# EAGLE design driver (EAGLE 9.6.2)
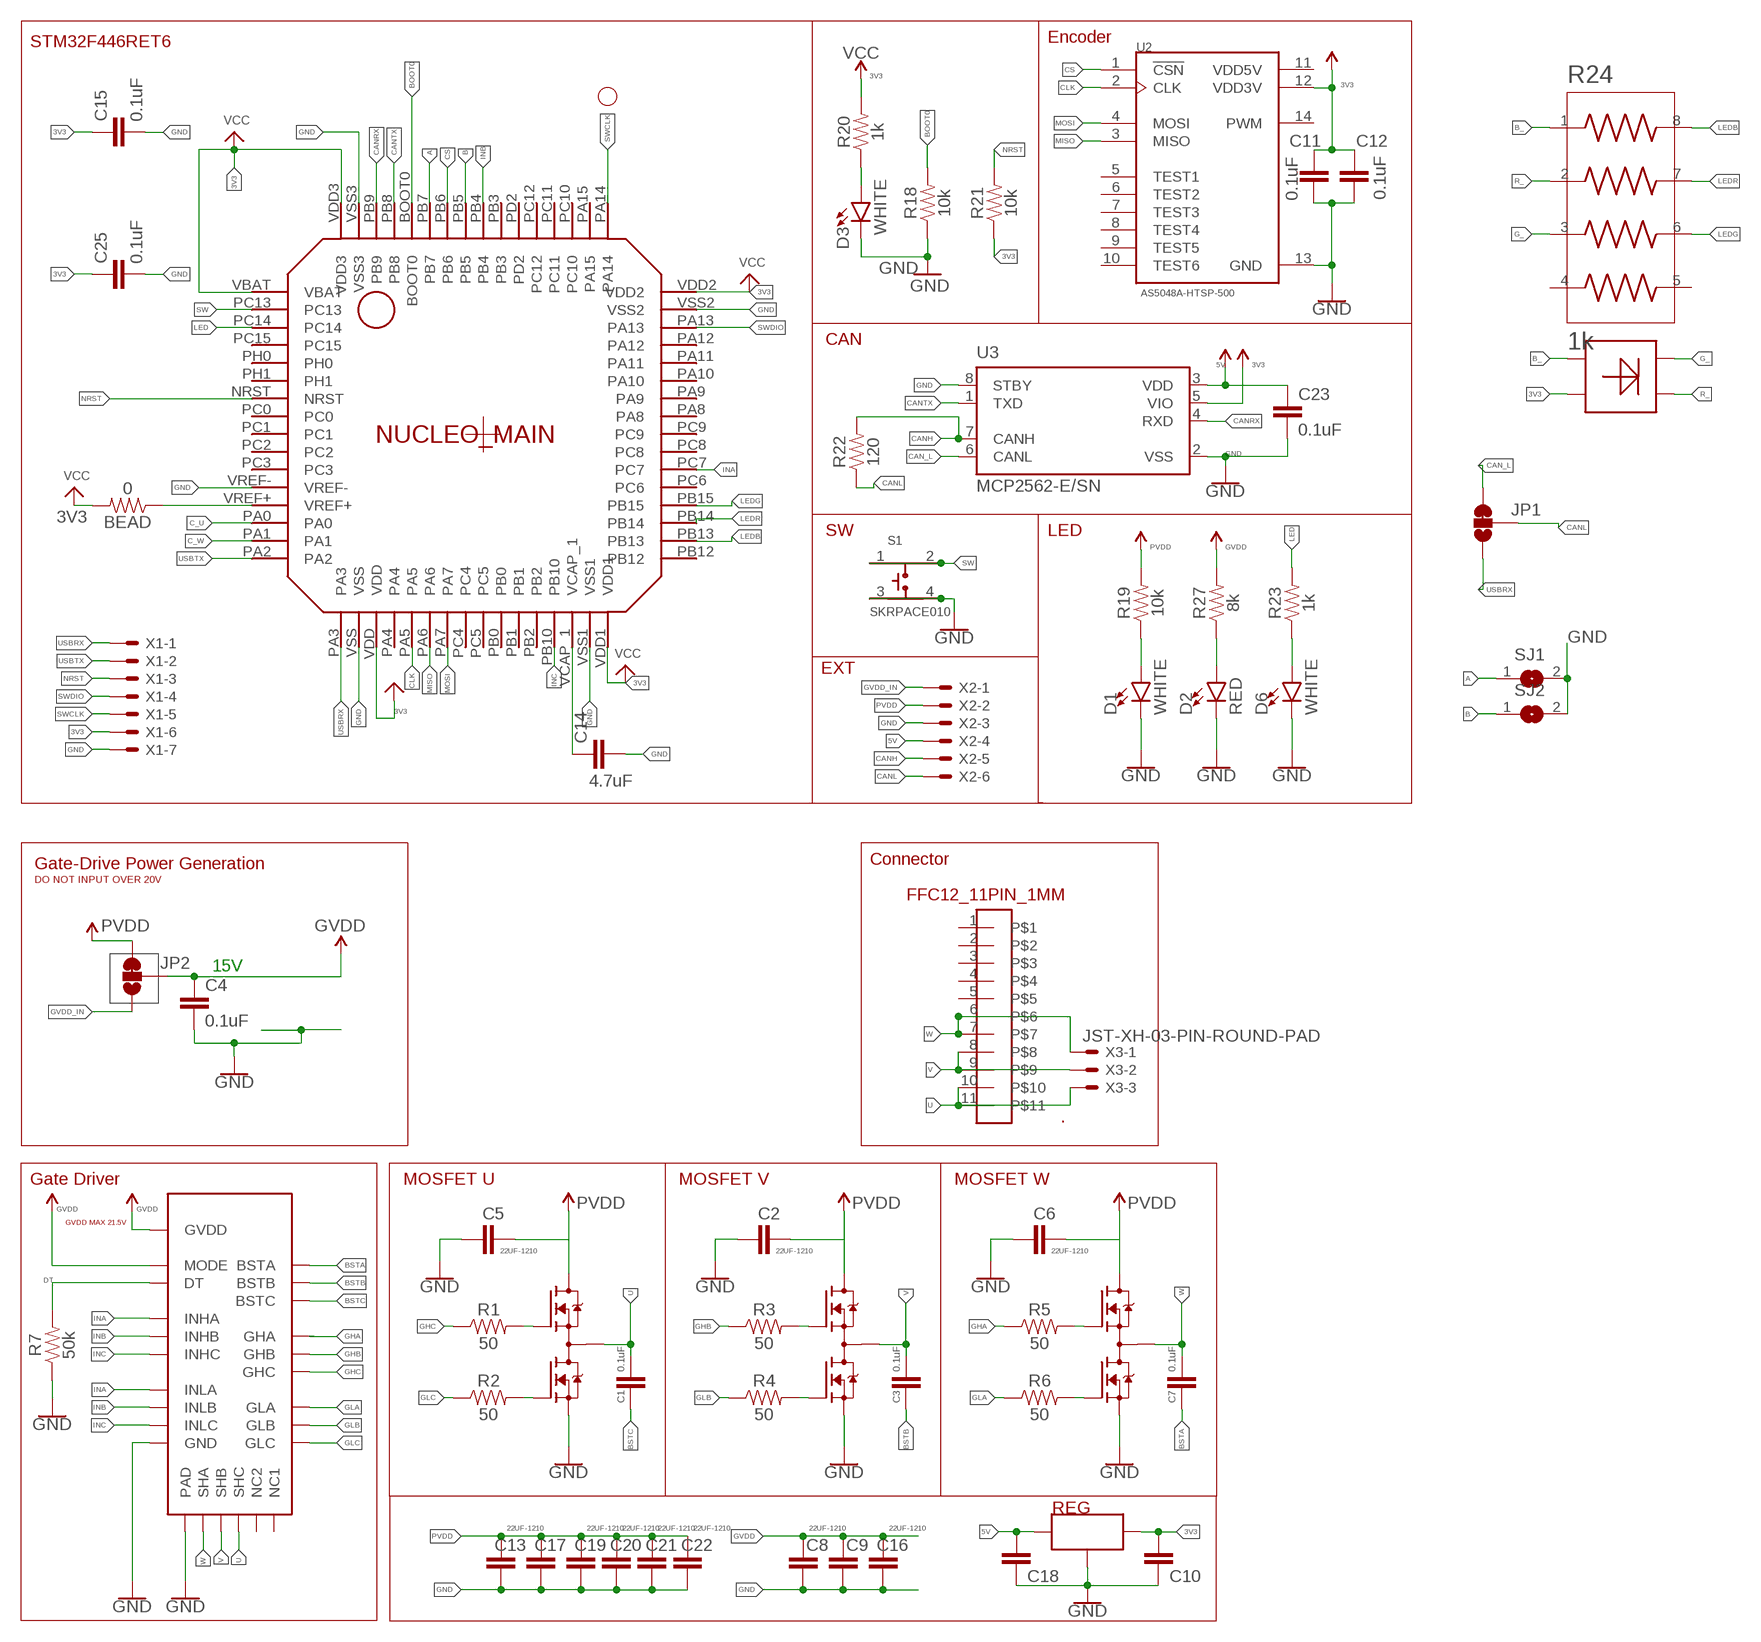
[diagram p0: schematic, sheet 1]

## Parts
.  FFC12_11PIN_1MM  [CON-SMT-FFCFPC_52207-1185]
BEAD  0  0OHM-0603-1/10W-5%  [0603]
C1  0.1uF  0.1UF-0603-25V-5%  [0603]
C2  22UF-1210  22UF-1210-16V-20%  [1210]
C3  0.1uF  0.1UF-0603-25V-5%  [0603]
C4  0.1uF  0.1UF-0603-100V-10%  [0603]
C5  22UF-1210  22UF-1210-16V-20%  [1210]
C6  22UF-1210  22UF-1210-16V-20%  [1210]
C7  0.1uF  0.1UF-0603-25V-5%  [0603]
C8  22UF-1210  22UF-1210-16V-20%  [1210]
C9  22UF-1210  22UF-1210-16V-20%  [1210]
C10  0.1UF  0.1UF_1608  [1608]
C11  0.1uF  0.1UF-0603-100V-10%  [0603]
C12  0.1uF  0.1UF-0603-100V-10%  [0603]
C13  22UF-1210  22UF-1210-16V-20%  [1210]
C14  4.7uF  0.1UF-0603-25V-(+80/-20%)  [0603]
C15  0.1uF  0.1UF-0603-25V-(+80/-20%)  [0603]
C16  22UF-1210  22UF-1210-16V-20%  [1210]
C17  22UF-1210  22UF-1210-16V-20%  [1210]
C18  0.1UF  0.1UF_1608  [1608]
C19  22UF-1210  22UF-1210-16V-20%  [1210]
C20  22UF-1210  22UF-1210-16V-20%  [1210]
C21  22UF-1210  22UF-1210-16V-20%  [1210]
C22  22UF-1210  22UF-1210-16V-20%  [1210]
C23  0.1uF  0.1UF-0603-100V-10%  [0603]
C25  0.1uF  0.1UF-0603-25V-(+80/-20%)  [0603]
D1  WHITE  LED-WHITE0603  [LED-0603]
D2  RED  LED-RED0603  [LED-0603]
D3  WHITE  LED-WHITE0603  [LED-0603]
D6  WHITE  LED-WHITE0603  [LED-0603]
JP1  JUMPER-SMT_3_1-NC_TRACE_SILK  [SMT-JUMPER_3_1-NC_TRACE_SILK]
JP2  JUMPER-SMT_3_1-NC_TRACE_SILK  [SMT-JUMPER_3_1-NC_TRACE_SILK]
NUCLEO_MAIN  F446RET6  STM32F446RET6  [STM32F446RET6]
Q2  SIZ240DT-T1-GE3  [TRANS_SIZ240DT-T1-GE3]
Q3  SIZ240DT-T1-GE3  [TRANS_SIZ240DT-T1-GE3]
Q4  SIZ240DT-T1-GE3  [TRANS_SIZ240DT-T1-GE3]
R1  50  1KOHM-0603-1/10W-1%  [0603]
R2  50  1KOHM-0603-1/10W-1%  [0603]
R3  50  1KOHM-0603-1/10W-1%  [0603]
R4  50  1KOHM-0603-1/10W-1%  [0603]
R5  50  1KOHM-0603-1/10W-1%  [0603]
R6  50  1KOHM-0603-1/10W-1%  [0603]
R7  50k  1KOHM-0603-1/10W-1%  [0603]
R18  10k  RESISTOR-0603-1/10W-1%  [R0603]
R19  10k  2.0KOHM-0603-1/10W-5%  [0603]
R20  1k  RESISTOR-0603-1/10W-1%  [R0603]
R21  10k  RESISTOR-0603-1/10W-1%  [R0603]
R22  120  2.0KOHM-0603-1/10W-5%  [0603]
R23  1k  2.0KOHM-0603-1/10W-5%  [0603]
R24  1k  MNR04M0APJ334  [RESCAXS50P200X100X45-8N]
R27  8k  2.0KOHM-0603-1/10W-5%  [0603]
REG  AP7333  [SOT95P237X112-3N]
S1  SKRPACE010  [SW_SKRPACE010]
SJ1  SJ  [SJ]
SJ2  SJ  [SJ]
U1  QFN50P400X400X100-25NDRV8300DRGER  [QFN50P400X400X100-25N]
U2  AS5048A-HTSP-500  [SOP65P640X120-14N]
U3  MCP2562-E/SN  [SOIC127P600X175-8N]
U$1  LED  [LED_AAA3528LSEKJ3ZGKQBKS]
X1  JST-XH-07-PIN-ROUND-PAD  [JST-XH-07-PACKAGE-ROUND-PAD]
X2  JST-XH-06-PIN-LONG-PAD  [JST-XH-06-PACKAGE-LONG-PAD]
X3  JST-XH-03-PIN-ROUND-PAD  [JST-XH-03-PACKAGE-ROUND-PAD]

## Nets
3V3: BEAD.2 C10.1 C11.1 C12.1 C15.1 C25.1 NUCLEO_MAIN.VBAT NUCLEO_MAIN.VDD NUCLEO_MAIN.VDD1 NUCLEO_MAIN.VDD2 NUCLEO_MAIN.VDD3 R20.2 R21.1 REG.2(OUT) U2.12(VDD3V) U3.5(VIO) U$1.4(GND) X1.6 ; supply symbol labelled PVDD, VCC, GVDD
5V: C18.1 C23.1 REG.1(IN) U3.3(VDD) X2.4 ; supply symbol labelled GVDD
A: NUCLEO_MAIN.PB7 SJ1.1
B: NUCLEO_MAIN.PB5 SJ2.1
B_: R24.1 U$1.1(B)
BOOT0: NUCLEO_MAIN.BOOT0 R18.2
BSTA: C7.1 U1.BSTA
BSTB: C3.1 U1.BSTB
BSTC: C1.1 U1.BSTC
C_U: NUCLEO_MAIN.PA0
C_W: NUCLEO_MAIN.PA1
CAN_L: JP1.3 U3.6(CANL)
CANH: R22.2 U3.7(CANH) X2.5
CANL: JP1.2 R22.1 X2.6
CANRX: NUCLEO_MAIN.PB9 U3.4(RXD)
CANTX: NUCLEO_MAIN.PB8 U3.1(TXD)
CLK: NUCLEO_MAIN.PA5 U2.2(CLK)
CS: NUCLEO_MAIN.PB6 U2.1(!CSN)
DT: R7.2 U1.DT
G_: R24.3 U$1.2(G)
GHA: R5.1 U1.GHA
GHB: R3.1 U1.GHB
GHC: R1.1 U1.GHC
GLA: R6.1 U1.GLA
GLB: R4.1 U1.GLB
GLC: R2.1 U1.GLC
GND: C2.1 C4.2 C5.1 C6.1 C8.1 C9.1 C10.2 C11.2 C12.2 C13.1 C14.2 C15.2 C16.1 C17.1 C18.2 C19.1 C20.1 C21.1 C22.1 C23.2 C25.2 D1.C D2.C D3.C D6.C NUCLEO_MAIN.VREF- NUCLEO_MAIN.VSS NUCLEO_MAIN.VSS1 NUCLEO_MAIN.VSS2 NUCLEO_MAIN.VSS3 Q2.5(S2) Q2.6(S2) Q2.7(S2) Q3.5(S2) Q3.6(S2) Q3.7(S2) Q4.5(S2) Q4.6(S2) Q4.7(S2) R7.1 R18.1 REG.3(GND) S1.3 S1.4 SJ1.2 SJ2.2 U1.GND U1.PAD U2.13(GND) U3.2(VSS) U3.8(STBY) X1.7 X2.3
GVDD: C4.1 C8.2 C9.2 C16.2 JP2.2 R27.2 U1.GVDD U1.MODE ; supply symbol labelled PVDD
GVDD_IN: JP2.1 X2.1
HA: Q4.1(G1) R5.2
HB: Q3.1(G1) R3.2
HC: Q2.1(G1) R1.2
INA: NUCLEO_MAIN.PC7 U1.INHA U1.INLA
INB: NUCLEO_MAIN.PB4 U1.INHB U1.INLB
INC: NUCLEO_MAIN.PB10 U1.INHC U1.INLC
L: D3.A R20.1
LA: Q4.8(G2) R6.2
LB: Q3.8(G2) R4.2
LC: Q2.8(G2) R2.2
LED: NUCLEO_MAIN.PC14 R23.2
LEDB: NUCLEO_MAIN.PB13 R24.8
LEDG: NUCLEO_MAIN.PB15 R24.6
LEDR: NUCLEO_MAIN.PB14 R24.7
MISO: NUCLEO_MAIN.PA6 U2.3(MISO)
MOSI: NUCLEO_MAIN.PA7 U2.4(MOSI)
N$14: D1.A R19.1
N$15: D2.A R27.1
N$21: D6.A R23.1
NRST: NUCLEO_MAIN.NRST R21.2 X1.3
PVDD: C2.2 C5.2 C6.2 C13.2 C17.2 C19.2 C20.2 C21.2 C22.2 JP2.3 Q2.2(D1) Q2.3(D1) Q2.4(D1) Q2.10(D1) Q3.2(D1) Q3.3(D1) Q3.4(D1) Q3.10(D1) Q4.2(D1) Q4.3(D1) Q4.4(D1) Q4.10(D1) R19.2 X2.2 ; supply symbol labelled GVDD
R_: R24.2 U$1.3(R)
SW: NUCLEO_MAIN.PC13 S1.1 S1.2
SWCLK: NUCLEO_MAIN.PA14 X1.5
SWDIO: NUCLEO_MAIN.PA13 X1.4
U: ..10 ..11 C1.2 Q2.9(S1/D2) U1.SHC X3.3
USBRX: JP1.1 NUCLEO_MAIN.PA3 X1.1
USBTX: NUCLEO_MAIN.PA2 X1.2
V: ..8 ..9 C3.2 Q3.9(S1/D2) U1.SHB X3.2
VCAP: C14.1 NUCLEO_MAIN.VCAP_1
VDDA: BEAD.1 NUCLEO_MAIN.VREF+
W: ..6 ..7 C7.2 Q4.9(S1/D2) U1.SHA X3.1
Unconnected: ..1 ..2 ..3 ..4 ..5 NUCLEO_MAIN.PA4 NUCLEO_MAIN.PA8 NUCLEO_MAIN.PA9 NUCLEO_MAIN.PA10 NUCLEO_MAIN.PA11 NUCLEO_MAIN.PA12 NUCLEO_MAIN.PA15 NUCLEO_MAIN.PB0 NUCLEO_MAIN.PB1 NUCLEO_MAIN.PB2 NUCLEO_MAIN.PB3 NUCLEO_MAIN.PB12 NUCLEO_MAIN.PC0 NUCLEO_MAIN.PC1 NUCLEO_MAIN.PC2 NUCLEO_MAIN.PC3 NUCLEO_MAIN.PC4 NUCLEO_MAIN.PC5 NUCLEO_MAIN.PC6 NUCLEO_MAIN.PC8 NUCLEO_MAIN.PC9 NUCLEO_MAIN.PC10 NUCLEO_MAIN.PC11 NUCLEO_MAIN.PC12 NUCLEO_MAIN.PC15 NUCLEO_MAIN.PD2 NUCLEO_MAIN.PH0 NUCLEO_MAIN.PH1 R24.4 R24.5 U1.NC1 U1.NC2 U2.5(TEST1) U2.6(TEST2) U2.7(TEST3) U2.8(TEST4) U2.9(TEST5) U2.10(TEST6) U2.14(PWM)

## Notes on the sheet
- STM32F446RET6 | Encoder
- CAN
- SW | LED
- Recommended
- EXT
- Gate-Drive Power Generation | Connector
- DO NOT INPUT OVER 20V
- 15V
- Gate Driver | MOSFET U | MOSFET V | MOSFET W
- GVDD MAX 21.5V

## Power pins joined to a net without a drawn wire
VDD5V: U2.11(VDD5V)

## Library data of the parts
. = MotorDriver_FourthEdition_prot:FFC12_11PIN_1MM
BEAD = SparkFun-Resistors:0OHM: 0Ω resistor A resistor is a passive two-terminal electrical component that implements electrical resistance as a circuit element. Resistors act to reduce current flow, and, at the same time, act to lower voltage levels within circuits. - Wikipedia; PROD_ID: RES-08609
C1 C3 C7 = SparkFun-Capacitors:0.1UF: 0.1µF ceramic capacitors A capacitor is a passive two-terminal electrical component used to store electrical energy temporarily in an electric field.; PROD_ID: CAP-08604
C2 C5 C6 C8 C9 C13 C16 C17 C19-C22 = SparkFun-Capacitors:22UF: 22µF ceramic capacitors A capacitor is a passive two-terminal electrical component used to store electrical energy temporarily in an electric field.
C4 C11 C12 C23 = SparkFun-Capacitors:0.1UF: 0.1µF ceramic capacitors A capacitor is a passive two-terminal electrical component used to store electrical energy temporarily in an electric field.; PROD_ID: CAP-08390
C10 C18 = Custom_Designed_By_Yusei:0.1UF_1608
C14 = SparkFun-Capacitors:0.1UF: 0.1µF ceramic capacitors A capacitor is a passive two-terminal electrical component used to store electrical energy temporarily in an electric field.; PROD_ID: CAP-00810; VALUE: 0.1uF
C15 C25 = SparkFun-Capacitors:0.1UF: 0.1µF ceramic capacitors A capacitor is a passive two-terminal electrical component used to store electrical energy temporarily in an electric field.; PROD_ID: CAP-00810
D1 D3 D6 = SparkFun-LED:LED-WHITE: White SMD LED Used in manufacturing several products at SparkFun. Packages: 0603 - Bright White SMD 0603 package[Product Link] <http://www.kingbrightusa.com/product.asp?catalog_name=LED&product_id=APT1608QWF/D> 1206 - Bright White SMD1206 package [Product Link] <http://www.kingbrightusa.com/product.asp?catalog_name=LED&product_id=APT3216QWF/D> 3014 - Super Bright SMD 3014 package [Datasheet] <http://www.lumileds.com/uploads/459/DS208-pdf> SparkFun Products: Blackberry Trackballer Breakout <https://www.sparkfun.com/products/13169> Digital SandBox <https://www.sparkfun.com/products/12651>; PROD_ID: DIO-09004
D2 = SparkFun-LED:LED-RED: Red SMD LED Used in manufacturing of most products at SparkFun Packages: 0603 - SMD 0603 package [Product Link] <http://docs.avagotech.com/docs/AV02-0551EN> 0603 SMART - SMD 0603 SMART package ( more efficient and expensive)[Product Link] <http://www.osram-os.com/Graphics/XPic2/00077099_0.pdf> 1206 - SMD1206 package [Product Link] <https://www.sparkfun.com/datasheets/DevTools/LilyPad/Q150OVS4.pdff> SparkFun Products: Pro Mini 328 -5V <https://www.sparkfun.com/products/821> RedBoard <https://www.sparkfun.com/products/12757> IOIO-OTG <https://www.sparkfun.com/products/13613>; PROD_ID: DIO-00819
JP1 JP2 = SparkFun-Jumpers:JUMPER-SMT_3_1-NC_TRACE: Normally closed trace jumper (1 of 2 connections) This jumper has a trace between two pads so it's normally closed (NC). The other connection is normally open (NO). Use a razor knife to open the connection. For best results follow the IPC guidelines for cutting traces: Cutout at least 0.063 mm (0.005 in). Remove all loose material to clean up the cut area. Seal the cut with an approved epoxy. Reapply solder to reclose the connection, or to close the NO connection.
NUCLEO_MAIN = STM32F446RET6:STM32F446RET6
Q2-Q4 = SIZ240DT-T1-GE3:SIZ240DT-T1-GE3: Check availability <https://pricing.snapeda.com/parts/SIZ240DT-T1-GE3/Vishay%20Siliconix/view-part?ref=eda>; AVAILABILITY: In Stock; DESCRIPTION: Mosfet Array 2 N-Channel (Dual) 40V 17.2A (Ta), 48A (Tc), 16.9A (Ta), 47A (Tc) 4.3W (Ta), 33W (Tc) Surface Mount 8-PowerPair® (3.3x3.3); MF: Vishay Siliconix; MP: SIZ240DT-T1-GE3; PACKAGE: PowerWDFN-8 Vishay Siliconix; PRICE: None; PURCHASE-URL: https://pricing.snapeda.com/search/part/SIZ240DT-T1-GE3/?ref=eda
R1-R7 = SparkFun-Resistors:1KOHM: 1kΩ resistor A resistor is a passive two-terminal electrical component that implements electrical resistance as a circuit element. Resistors act to reduce current flow, and, at the same time, act to lower voltage levels within circuits. - Wikipedia; PROD_ID: RES-07856; VALUE: 1k
R18 R21 = Custom_Designed_By_Yusei:RESISTOR: Resistor; PROD_ID: RES-07856; VALUE: 1k
R19 R22 R23 R27 = SparkFun-Resistors:2.0KOHM: 2kΩ resistor A resistor is a passive two-terminal electrical component that implements electrical resistance as a circuit element. Resistors act to reduce current flow, and, at the same time, act to lower voltage levels within circuits. - Wikipedia; PROD_ID: RES-08296; VALUE: 2.0k
R20 = Custom_Designed_By_Yusei:RESISTOR: Resistor; PROD_ID: RES-07856
R24 = MNR04M0APJ334:MNR04M0APJ334: Res Array 330K Ohm 5% ±200ppm/°C ISOL Epoxy 8-Pin 0804(4 X 0402) Convex SMD Automotive T/R Check availability <https://pricing.snapeda.com/parts/MNR04M0APJ334/Rohm/view-part?ref=eda>; AVAILABILITY: In Stock; DESCRIPTION: Res Array 330K Ohm 5% ±200ppm/°C ISOL Epoxy 8-Pin 0804(4 X 0402) Convex SMD Automotive T/R; MF: Rohm; MP: MNR04M0APJ334; PACKAGE: 0402 Rohm; PRICE: None
REG = SOT95P237X112-3N:AP7333
S1 = Alps SW:SKRPACE010: Switch Tactile N.O. SPST Button J-Bend 0.05A 16VDC 2.55N SMD Automotive T/R; AVAILABILITY: Good; DESCRIPTION: Switch Tactile N.O. SPST Button J-Bend 0.05A 16VDC 2.55N SMD Automotive T/R; MF: ALPS; MP: SKRPACE010; PACKAGE: None; PRICE: 0.29 USD
SJ1 SJ2 = jumper:SJ: SMD solder JUMPER
U1 = DRV8300DRGER:QFN50P400X400X100-25N: DRV8300
U2 = AS5048A-HTSP-500:AS5048A-HTSP-500: AS5048B Series 360° 3.3 / 5 V 14 bit Magnetic Rotary Encoder - TSSOP-14 Check availability <https://pricing.snapeda.com/parts/AS5048A-HTSP-500/ams/view-part?ref=eda>; AVAILABILITY: In Stock; DESCRIPTION: Hall Effect Sensor Angle External Magnet, Not Included Gull Wing; MF: ams; MP: AS5048A-HTSP-500; PACKAGE: TSSOP-14 ams; PRICE: None; PURCHASE-URL: https://pricing.snapeda.com/search/part/AS5048A-HTSP-500/?ref=eda
U3 = MCP2562-E_SN:MCP2562-E/SN: MCP2562 Series 5 V Surface Mount High-Speed CAN Transceiver - SOIC-8 Check availability <https://pricing.snapeda.com/parts/MCP2562-E/SN/Microchip/view-part?ref=eda>; AVAILABILITY: In Stock; DESCRIPTION: 1/1 Transceiver Half CANbus 8-SOIC; MF: Microchip; MP: MCP2562-E/SN; PACKAGE: SO-8 Microchip; PRICE: None; PURCHASE-URL: https://pricing.snapeda.com/search/part/MCP2562-E/SN/?ref=eda
U$1 = LED_AAA3528LSEKJ3ZGKQBKS:LED
X1 = JST XH Connectors:JST-XH-07-PIN: JST XH Connector 2 Pin Wire to board connector. Pitch: 2,54 mm, (0.100") Number of pins: 7 Created by Rembrandt Electronics www.rembrandtelectronics.com
X2 = Rembrandt Electronics - JST XH Connectors v1-0:JST-XH-06-PIN: JST XH Connector 2 Pin Wire to board connector. Pitch: 2,54 mm, (0.100") Number of pins: 6 Created by Rembrandt Electronics www.rembrandtelectronics.com
X3 = JST XH Connectors:JST-XH-03-PIN: JST XH Connector 2 Pin Wire to board connector. Pitch: 2,54 mm, (0.100") Number of pins: 3 Created by Rembrandt Electronics www.rembrandtelectronics.com

## Net classes
0 default: width 0.3 mm

## Board
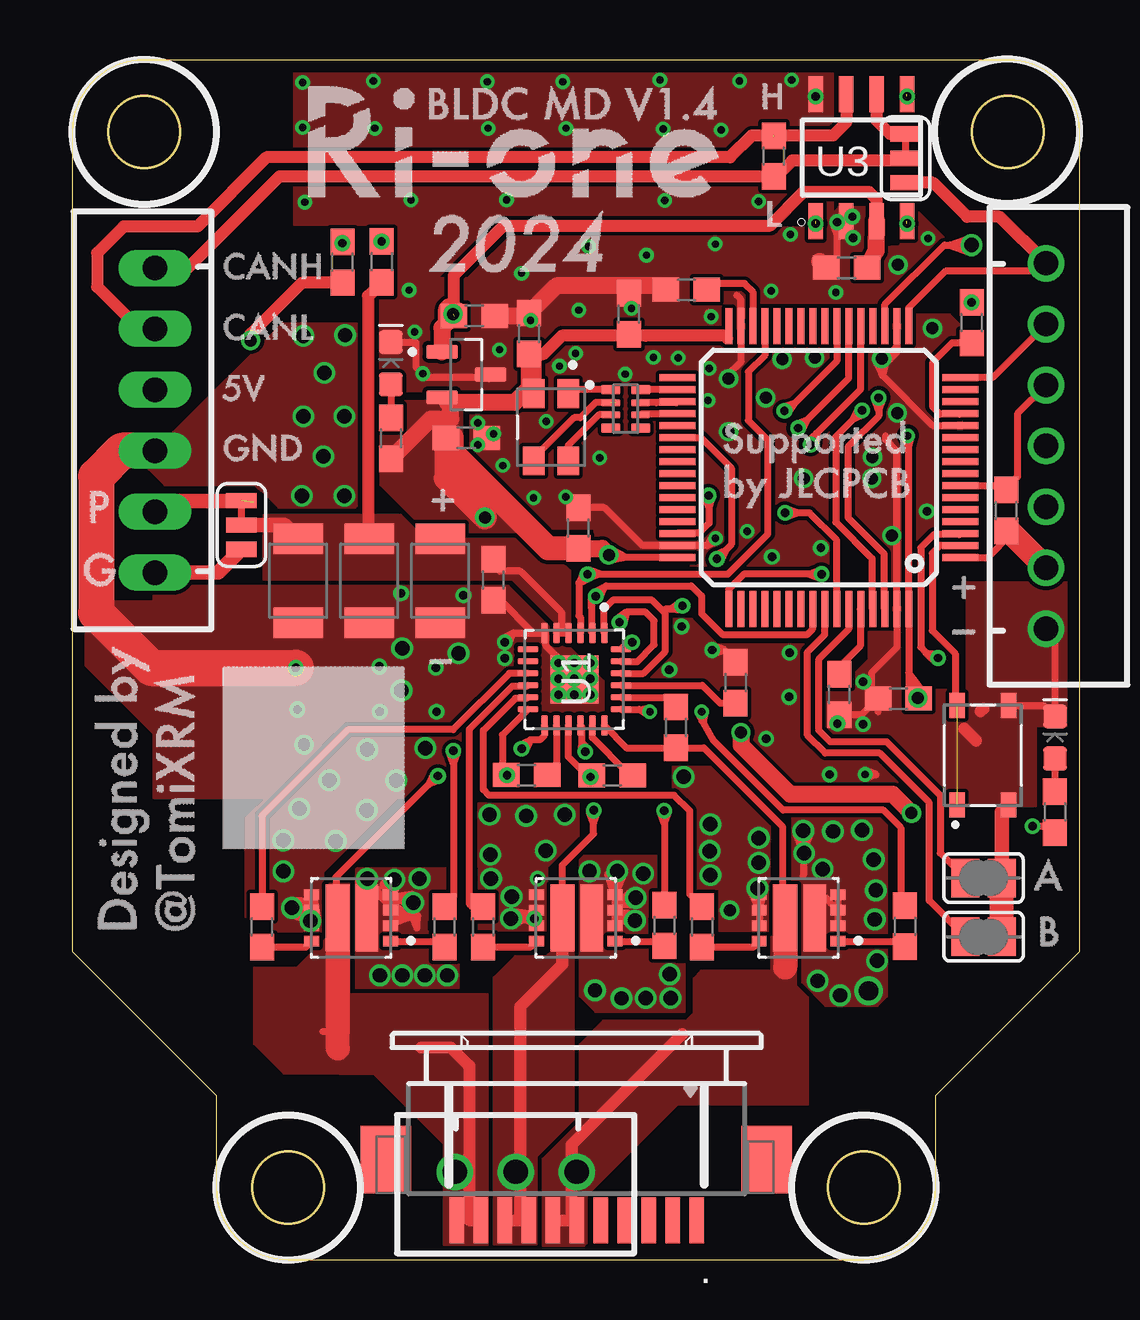
[diagram p1: board, top side]
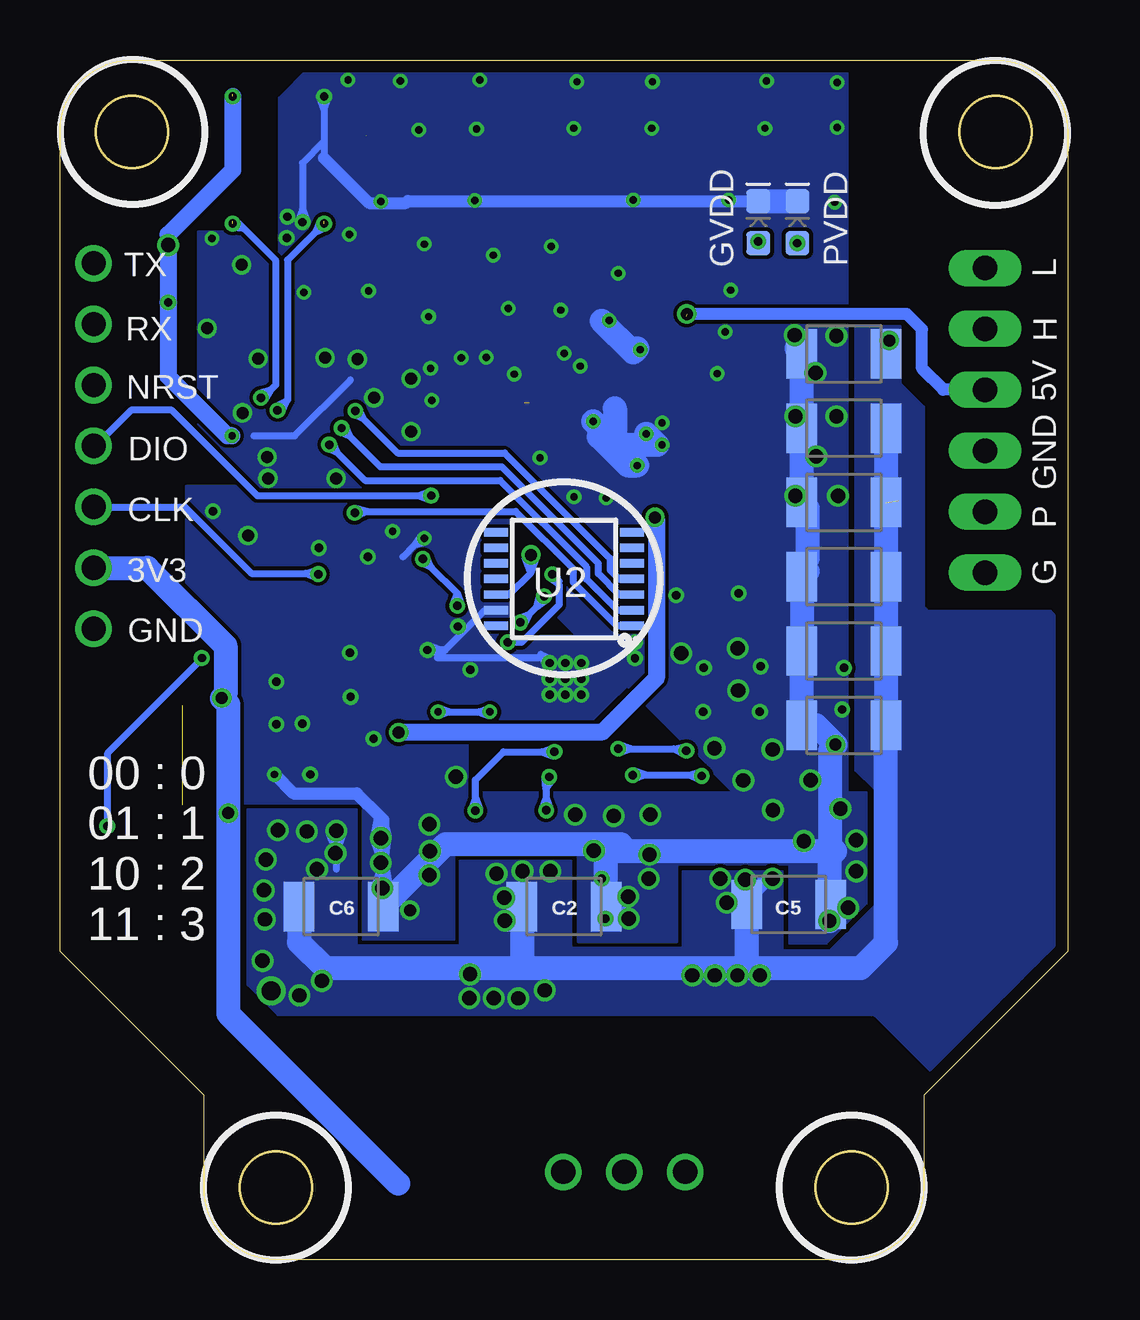
[diagram p2: board, bottom side, seen from below]

Size 42 x 50 mm. Coordinates in mm from the lower left corner, seen from the top.
Outline: 3,50 arc90 0,47 0,12.85 6,6.85 6,3 arc90 9,0 33,0 arc90 36,3 36,6.85 42,12.85 42,47 arc90 39,50 3,50
Outline: circle at 3,47 radius 1.5
Outline: circle at 39,47 radius 1.5
Outline: circle at 9,3 radius 1.5
Outline: circle at 33,3 radius 1.5
Outline: circle at 39,47 radius 1.5
Copper layers (1*16): Top 0.035mm / dielectric 1.6mm / Bottom 0.035mm
Design rules "Elecrow_2-layer_PCB_eagle_rule": minimum track width 6mil, minimum drill 12mil, track to track 6mil, track to pad 6mil, pad to pad 6mil, via to via 8mil, smd to smd 0mil, copper to edge 20mil, drill to drill 10mil, minimum pad ring 6mil, minimum via ring 6mil, stop-mask expansion 0mil, vias tented up to drill 100mil, thermal gap 10mil
tRestrict: area 6,0 to 12,6; area 30,0 to 36,6; area 0,44 to 6,50; area 36,44 to 42,50; 7 lines
bRestrict: area 0,44 to 6,50; area 36,44 to 42,50; 2 lines

### Footprints (pad centres in the part's own frame; a part is rotated, then mirrored left to right if it is on the bottom)
CON-SMT-FFCFPC_52207-1185 = smd 0.6 x 1.9: 1 -5,2.5; 2 -4,2.5; 3 -3,2.5; 4 -2,2.5; 5 -1,2.5; 6 0,2.5; 7 1,2.5; 8 2,2.5; 9 3,2.5; 10 4,2.5; 11 5,2.5 | smd 2.1 x 2.8: P$1 -7.93,-0.03; P$4 7.945,-0.03
0603 = smd 1.1 x 1: 1 -0.85,0; 2 0.85,0
1210 = smd 1.27 x 2.06: 1 -1.755,0; 2 1.755,0
1608 = smd 1.1 x 1: 1 -0.85,0; 2 0.85,0
LED-0603 = smd 1 x 1: A -0.877,0; C 0.877,0
SMT-JUMPER_3_1-NC_TRACE_SILK = smd 0.635 x 1.27: 1 -1.016,0; 2 0,0; 3 1.016,0
STM32F446RET6 = smd 0.3 x 1.5: BOOT0 -1.75,5.9; PA3 -3.75,-5.9; PA4 -2.25,-5.9; PA5 -1.75,-5.9; PA6 -1.25,-5.9; PA7 -0.75,-5.9; PA14 3.75,5.9; PA15 3.25,5.9; PB0 0.75,-5.9; PB1 1.25,-5.9; PB2 1.75,-5.9; PB3 0.75,5.9; PB4 0.25,5.9; PB5 -0.25,5.9; PB6 -0.75,5.9; PB7 -1.25,5.9; PB8 -2.25,5.9; PB9 -2.75,5.9; PB10 2.25,-5.9; PC4 -0.25,-5.9; PC5 0.25,-5.9; PC10 2.75,5.9; PC11 2.25,5.9; PC12 1.75,5.9; PD2 1.25,5.9; VCAP_1 2.75,-5.9; VDD -2.75,-5.9; VDD1 3.75,-5.9; VDD3 -3.75,5.9; VSS -3.25,-5.9; VSS1 3.25,-5.9; VSS3 -3.25,5.9 | smd 1.5 x 0.3: NRST -5.9,0.75; PA0 -5.9,-2.75; PA1 -5.9,-3.25; PA2 -5.9,-3.75; PA8 5.9,0.25; PA9 5.9,0.75; PA10 5.9,1.25; PA11 5.9,1.75; PA12 5.9,2.25; PA13 5.9,2.75; PB12 5.9,-3.75; PB13 5.9,-3.25; PB14 5.9,-2.75; PB15 5.9,-2.25; PC0 -5.9,0.25; PC1 -5.9,-0.25; PC2 -5.9,-0.75; PC3 -5.9,-1.25; PC6 5.9,-1.75; PC7 5.9,-1.25; PC8 5.9,-0.75; PC9 5.9,-0.25; PC13 -5.9,3.25; PC14 -5.9,2.75; PC15 -5.9,2.25; PH0 -5.9,1.75; PH1 -5.9,1.25; VBAT -5.9,3.75; VDD2 5.9,3.75; VREF+ -5.9,-2.25; VREF- -5.9,-1.75; VSS2 5.9,3.25
TRANS_SIZ240DT-T1-GE3 = smd 0.62 x 0.44: 1 -1.64,0.975; 2 -1.64,0.325; 3 -1.64,-0.325; 4 -1.64,-0.975; 5 1.64,-0.975; 6 1.64,-0.325; 7 1.64,0.325; 8 1.64,0.975 | smd 1.005 x 2.8: 9 0.557,0 | smd 0.935 x 2.8: 10 -0.662,0
R0603 = smd 1.1 x 1: 1 -0.85,0; 2 0.85,0
RESCAXS50P200X100X45-8N = smd 0.79 x 0.39: 1 -0.62,0.8; 4 -0.62,-0.8; 5 0.62,-0.8; 8 0.62,0.8 | smd 0.79 x 0.29: 2 -0.62,0.25; 3 -0.62,-0.25; 6 0.62,-0.25; 7 0.62,0.25
SOT95P237X112-3N = smd 1.32 x 0.59: 1 -1.015,0.95; 2 -1.015,-0.95; 3 1.015,0
SW_SKRPACE010 = smd 1.05 x 0.65: 1 -2.075,1.075; 2 2.075,1.075; 3 -2.075,-1.075; 4 2.075,-1.075
SJ = smd 1.168 x 1.6: 1 -0.762,0; 2 0.762,0
QFN50P400X400X100-25N = smd 0.27 x 0.86: BSTA 0.75,1.935; DT 0.25,1.935; GHA 1.25,1.935; GLA 0.75,-1.935; GLB 0.25,-1.935; GLC -0.25,-1.935; INHA -0.25,1.935; INHB -0.75,1.935; INHC -1.25,1.935; NC1 -1.25,-1.935; NC2 -0.75,-1.935; SHC 1.25,-1.935 | smd 0.86 x 0.27: BSTB 1.935,0.75; BSTC 1.935,-0.75; GHB 1.935,0.25; GHC 1.935,-1.25; GND -1.935,-1.25; GVDD -1.935,-0.25; INLA -1.935,1.25; INLB -1.935,0.75; INLC -1.935,0.25; MODE -1.935,-0.75; SHA 1.935,1.25; SHB 1.935,-0.25 | smd 2 x 2: PAD 0,0
SOP65P640X120-14N = smd 1 x 0.35: 1 -2.825,1.95; 2 -2.825,1.3; 3 -2.825,0.65; 4 -2.825,0; 5 -2.825,-0.65; 6 -2.825,-1.3; 7 -2.825,-1.95; 8 2.825,-1.95; 9 2.825,-1.3; 10 2.825,-0.65; 11 2.825,0; 12 2.825,0.65; 13 2.825,1.3; 14 2.825,1.95
SOIC127P600X175-8N = smd 1.5 x 0.6: 1 -2.65,1.905; 2 -2.65,0.635; 3 -2.65,-0.635; 4 -2.65,-1.905; 5 2.65,-1.905; 6 2.65,-0.635; 7 2.65,0.635; 8 2.65,1.905
LED_AAA3528LSEKJ3ZGKQBKS = smd 1.2 x 0.9: 1 -1.4,0.725; 2 1.4,0.725; 3 1.4,-0.725; 4 -1.4,-0.725
JST-XH-07-PACKAGE-ROUND-PAD = drill 1.016: 1 -7.62,0; 2 -5.08,0; 3 -2.54,0; 4 0,0; 5 2.54,0; 6 5.08,0; 7 7.62,0
JST-XH-06-PACKAGE-LONG-PAD = drill 1.016 long: 1 -6.35,0; 2 -3.81,0; 3 -1.27,0; 4 1.27,0; 5 3.81,0; 6 6.35,0
JST-XH-03-PACKAGE-ROUND-PAD = drill 1.016: 1 -2.54,0; 2 0,0; 3 2.54,0

### Placement (x,y rotation side)
.  21.02,4.14 180 top
BEAD  37.49,39.05 90 top
C1  18.95,20.19 180 top
C2  20.99,14.72 180 bottom
C3  22.51,20.18 180 top
C4  17.55,28.33 270 top
C5  11.62,14.8 180 bottom
C6  30.28,14.72 180 bottom
C7  25.16,22.18 270 top
C8  15.34,28.29 90 top
C9  12.38,28.29 90 top
C10  16.43,34.25 0 top
C11  34.44,23.39 180 top
C12  19.05,38.6 90 top
C13  9.32,34.65 0 bottom
C14  25.6,40.43 180 top
C15  21.1,30.49 90 top
C16  9.42,28.29 90 top
C17  9.32,31.56 0 bottom
C18  16.76,39.33 0 top
C19  9.32,28.46 0 bottom
C20  9.32,25.36 0 bottom
C21  9.32,22.27 0 bottom
C22  9.32,37.75 0 bottom
C23  32.28,41.33 180 top
C25  23.21,39.41 90 top
D1  11.26,43.24 90 bottom
D2  12.89,43.24 90 bottom
D3  13.28,37.36 90 top
D6  40.97,21.76 90 top
JP1  34.74,45.9 90 top
JP2  7.05,30.62 90 top
NUCLEO_MAIN  31.12,33.01 180 top
Q2  11.62,14.24 180 top
Q3  20.99,14.24 180 top
Q4  30.28,14.24 180 top
R1  15.52,13.87 270 top
R2  7.91,13.87 270 top
R3  24.68,13.92 270 top
R4  17.12,13.87 270 top
R5  34.72,13.89 270 top
R6  26.25,13.87 270 top
R7  27.65,24.05 270 top
R18  31.98,23.55 90 top
R19  11.26,41.57 270 top
R20  13.28,34.23 270 top
R21  38.93,31.23 90 top
R22  29.25,45.99 90 top
R23  40.97,18.65 270 top
R24  23.07,35.46 0 top
R27  12.9,41.59 270 top
REG  16.43,36.89 0 top
S1  37.96,21.02 90 top
SJ1  37.99,15.9 0 top
SJ2  37.99,13.45 0 top
U1  20.93,24.19 270 top
U2  20.99,28.37 180 bottom
U3  32.9,45.93 90 top
U$1  19.96,34.69 270 top
X1  40.6,33.91 270 top
X2  3.45,34.98 90 top
X3  18.48,3.65 180 top

### Tracks (layer width: path | path; a pad name or v marks a point on that pad's centre or on a via)
3V3  (via drill 0.3, 0.35, 0.5, 0.6)  (1 unrouted)
  Top 0.3: R21.1 39.07,30.23 39.13,30.23 38.16,29.27 NUCLEO_MAIN.VBAT | NUCLEO_MAIN.VDD1 27.37,38.45 27.31,38.39 | 15.78,35.67 15.73,35.72 | 15.63,35.72 REG.2 | 15.83,34.25 C10.1 | NUCLEO_MAIN.VDD2 23.11,29.27 | 21.47,29.27 C15.1 21.4,29.37 | v34.83,34.34 34.87,34.29 34.87,33.88 | 34.87,33.88 NUCLEO_MAIN.VDD3 34.87,24.46 | 34.87,24.46 34.87,23.8 C11.1 | NUCLEO_MAIN.VDD 33.88,38.93 33.88,39.81 36.35,42.28 36.59,42.28 | 36.59,42.28 v37.49,42.28 | 23.11,29.27 22.48,29.6 v22.37,29.37 22.42,29.13 23.11,29.27 | 34.87,33.88 34.98,34.3 v34.83,34.34 | 34.87,33.88 34.69,34.27 v34.83,34.34 | 35.07,24.18 35.02,23.42 v35.25,23.41 35.49,23.57 35.07,24.18 | 34.87,24.46 35.07,24.18 | 36.59,42.28 37.39,42 v37.49,42.28 | 36.59,42.28 37.39,42.57 v37.49,42.28 | C25.1 23.85,38.56 23.91,38.51
  Top 0.5: C12.1 19.65,37.75 20.41,38.51 23.91,38.51 27.19,38.51 27.31,38.39 | U$1.4 19.23,36.29
  Top 0.7: C10.1 15.58,35.03 | 15.78,35.67 15.78,35.03 15.58,35.03 | R20.2 14.93,35.03 15.58,35.03 | 15.63,35.72 15.73,35.72 18.45,35.72 19.05,36.32 C12.1 19.23,37.57 U$1.4 | v34.98,18.61 34.2,19.39 29.93,19.39 27.88,21.45 v27.88,21.97 | C15.1 22.1,29.64 v22.37,29.37
  Top 1: v35.25,23.41 35.29,23.41 C11.1 | 15.83,33.43 15.83,34.25 | v17.2,30.93 15.58,32.56 C10.1 15.58,33.91 19.85,29.64 C15.1 | X1.6 39.05,30.38 R21.1
  Bottom 0.3: U2.12 23.28,27.72 22.37,28.62 | 22.37,28.62 22.37,28.63 v22.37,29.37 | 22.37,28.62 22.6,29.29 v22.37,29.37 | 22.37,28.62 22.13,29.29 v22.37,29.37
  Bottom 0.7: v27.88,21.97 27.85,22 19.38,22 17.14,24.23 17.14,30.88 v17.2,30.93 | v34.8,48.48 34.8,45.42 37.49,42.73 v37.49,42.28 BEAD.2 37.49,36.8 35.03,34.34 v34.83,34.34
  Bottom 1: 27.9,3.16 34.99,10.25 v34.99,18.6 v34.98,18.61 34.98,23.14 v35.25,23.41 35.1,23.55 35.1,25.57 38.35,28.83 X1.6
  other vias: 37.49,39.9
  pour Top (no thermals): 12.86,35.77 12.86,32.28 14.82,30.32 19.61,30.32 19.61,30.46 16.26,33.81 16.26,35.77
5V  (via drill 0.5)  (1 unrouted)
  Top 0.3: C18.1 15.7,39.11
  Top 0.5: 16.11,39.65 v15.87,39.41 | C18.1 15.91,41.02 17.98,43.1 29.1,43.1 30.5,44.5 33.22,44.5 33.53,44.19 U3.3
  Top 0.7: 15.7,39.11 15.7,39.71 15.61,39.62 15.61,39.03 15.41,38.83 REG.1 | U3.3 33.51,42.05 C23.1
  Bottom 0.5: X2.4 5.18,36.25 6.06,37.14 6.06,38.78 6.7,39.41 v15.87,39.41
A
  Top 0.3: SJ1.1 36.19,16.94 36.19,19.35 33.95,21.59 31.59,21.59 31.11,22.07 31.11,25.01 32.37,26.27 NUCLEO_MAIN.PB7
B
  Top 0.3: SJ2.1 35.72,14.96 35.72,19.05 33.66,21.11 31.39,21.11 30.65,21.85 30.65,25.33 31.37,26.05 NUCLEO_MAIN.PB5
B_
  Top 0.3: 20.92,36.33 U$1.1 20.85,36.26 R24.1
BOOT0
  Top 0.3: NUCLEO_MAIN.BOOT0 32.85,27.1 32.85,25.58 31.98,24.71 R18.2
BSTA
  Top 0.3: C7.1 24.75,23.44 U1.BSTA
BSTB
  Top 0.3: C3.1 23.27,20.27 23.17,20.27 21.68,21.76 U1.BSTB
BSTC
  Top 0.3: C1.1 20.18,20.58 U1.BSTC
CAN_L
  Top 0.5: U3.6 33.53,47.49 34.1,46.92 JP1.3
CANH  (1 unrouted)
  Top 0.5: U3.7 32.26,47.4 31.71,46.85 R22.2 | X2.5 2.8,38.79 1.04,40.55 1.04,41.96 2.15,43.06 5.21,43.06 8.09,45.94 27.42,45.94 28.33,46.85 29.23,46.85
CANL
  Top 0.5: X2.6 4.82,41.33 8.63,45.14 R22.1 29.35,45.14 30.01,45.81 34.65,45.81 JP1.2
CANRX  (via drill 0.35)  (1 unrouted)
  Top 0.3: NUCLEO_MAIN.PB9 33.84,27.14 33.84,29.42 32.34,30.92 32.34,33.88 33.62,35.16 33.62,35.39 | v33.62,35.92 33.62,35.39 | 33.62,35.39 33.79,35.86 v33.62,35.92 | 33.62,35.39 33.45,35.86 v33.62,35.92
  Bottom 0.3: v33.62,35.92 33.58,35.88 33.21,36.24 | 33.21,36.24 32.99,36.46 32.99,41.63 34.32,42.96 | 34.32,42.96 34.54,43.18 v34.8,43.18 | 33.21,36.24 33.47,35.83 v33.62,35.92 | 33.21,36.24 33.68,36.09 v33.62,35.92 | 34.32,42.96 34.82,43 v34.8,43.18 | 34.32,42.96 34.68,43.31 v34.8,43.18
CANTX  (via drill 0.35)  (1 unrouted)
  Top 0.3: NUCLEO_MAIN.PB8 33.34,27.14 33.34,29.22 31.83,30.73 31.83,34.3 32.56,35.03 | v32.93,35.4 32.56,35.03 | 32.56,35.03 33.01,35.24 v32.93,35.4 | 32.56,35.03 32.77,35.48 v32.93,35.4
  Bottom 0.3: v30.99,43.18 31.36,42.81 | 31.36,42.81 32.51,41.66 32.51,35.8 32.53,35.8 32.56,35.77 | v32.93,35.4 32.56,35.77 | 32.56,35.77 32.77,35.33 v32.93,35.4 | 32.56,35.77 33.01,35.56 v32.93,35.4 | 31.36,42.81 31.15,43.26 v30.99,43.18 | 31.36,42.81 30.92,43.02 v30.99,43.18
CLK  (via drill 0.35)
  Top 0.3: v30.78,33.97 30.66,34.08 31.02,34.43 | 31.02,34.43 32.87,36.29 NUCLEO_MAIN.PA5 | 31.02,34.43 30.66,34.1 v30.78,33.97 | 31.02,34.43 30.95,33.94 v30.78,33.97
  Bottom 0.3: v30.78,33.97 30.41,33.59 | 30.41,33.59 29.29,32.47 23.65,32.47 20.06,28.88 20.06,28.36 18.77,27.07 U2.2 | 30.41,33.59 30.85,33.81 v30.78,33.97 | 30.41,33.59 30.62,34.04 v30.78,33.97
CS  (via drill 0.35)
  Top 0.3: NUCLEO_MAIN.PB6 31.87,29.99 30.73,31.12 v29.72,31.12 | v29.72,31.12 | v29.72,31.12 29.78,31.29 30.24,31.12 29.78,30.96 v29.72,31.12
  Bottom 0.3: U2.1 18.8,26.42 20.6,28.22 20.6,28.78 23,31.18 29.72,31.18 v29.72,31.12 | v29.72,31.12 29.64,30.96 29.19,31.18 29.67,31.3 v29.72,31.12
DT
  Top 0.3: U1.DT 26.27,23.94 27.01,23.2 R7.2
G_
  Top 0.3: U$1.2 20.68,33.95 21.95,35.21 R24.3
GHA  (via drill 0.3)
  Top 0.3: U1.GHA 23.64,22.94 | 23.64,22.94 23.97,22.94 v24.08,22.83 | R5.1 34.53,14.92 34.53,18 33.81,18.73 29.63,18.73 26.76,21.6 26.32,22.38 | 26.32,22.38 26.24,22.45 v26.24,22.83 | 23.64,22.94 23.99,22.7 v24.08,22.83 | 23.64,22.94 24.06,22.98 v24.08,22.83 | 26.32,22.38 26.39,22.8 v26.24,22.83 | 26.32,22.38 26.11,22.75 v26.24,22.83
  Bottom 0.3: v26.24,22.83 | v26.24,22.83 25.79,22.83 | 25.79,22.83 24.54,22.83 | 24.54,22.83 v24.08,22.83 | 24.54,22.83 24.13,22.97 v24.08,22.83 | 24.54,22.83 24.13,22.68 v24.08,22.83 | 25.79,22.83 26.19,22.68 v26.24,22.83 | 25.79,22.83 26.19,22.97 v26.24,22.83
GHB  (via drill 0.35)
  Top 0.3: U1.GHB 21.23,22.2 21.23,21.66 | 21.23,21.66 21.23,21.57 21.39,21.41 v21.39,21.16 | v24.68,18.7 24.68,18.18 | 24.68,18.18 R3.1 | 21.23,21.66 21.21,21.17 v21.39,21.16 | v21.39,21.16 21.53,21.27 | 24.68,18.18 24.85,18.65 v24.68,18.7 | 24.68,18.18 24.51,18.65 v24.68,18.7
  Bottom 0.3: v24.68,18.7 24.68,19.23 | 24.68,19.23 24.68,20 23.52,21.16 21.91,21.16 | 21.91,21.16 v21.39,21.16 | 21.91,21.16 21.45,21.33 v21.39,21.16 | 21.91,21.16 21.45,21 v21.39,21.16 | 24.68,19.23 24.51,18.77 v24.68,18.7 | 24.68,19.23 24.85,18.77 v24.68,18.7
GHC  (via drill 0.35)
  Top 0.3: v15.89,21.2 15.89,20.68 | 15.89,20.68 15.89,15.09 R1.1 | U1.GHC 19.68,21.85 19.49,21.66 19.11,21.66 19.1,21.66 | 19.1,21.66 v18.73,21.29 | 15.89,20.68 16.06,21.14 v15.89,21.2 | 15.89,20.68 15.72,21.14 v15.89,21.2 | 19.1,21.66 18.66,21.45 v18.73,21.29 | 19.1,21.66 18.89,21.21 v18.73,21.29
  Bottom 0.3: v15.89,21.2 15.98,21.29 16.41,21.29 | v18.73,21.29 18.21,21.29 | 18.21,21.29 16.41,21.29 | 16.41,21.29 15.92,21.38 v15.89,21.2 | 16.41,21.29 15.98,21.05 v15.89,21.2 | 18.21,21.29 18.67,21.12 v18.73,21.29 | 18.21,21.29 18.67,21.46 v18.73,21.29
GLA
  Top 0.3: U1.GLA 18.95,23.39 18.48,23.39 17.14,22.05 17.14,19.58 17.37,19.35 25.09,19.35 25.73,18.71 25.73,15.23 R6.1
GLB
  Top 0.3: U1.GLB 18.95,23.89 18.34,23.89 16.55,22.1 16.55,14.83 16.66,14.71 R4.1
GLC
  Top 0.3: U1.GLC 18.22,24.44 15.88,22.09 11.5,22.09 7.91,18.5 R2.1
GND  (via drill 0.3, 0.35, 0.5, 0.6)
  Top 0.3: v26.68,25.41 27.2,25.41 | C4.2 17.85,27.48 19.21,26.12 | 18.38,26.12 19.21,26.12 | 19.21,26.12 U1.GND 19.73,26.07 19.73,25.6 20.41,24.92 | 20.93,24.34 20.93,24.4 20.67,24.66 | 20.93,24.34 U1.PAD 21.23,24.48 | 20.41,24.92 20.67,24.66 | 21.23,24.48 21.31,24.57 | 21.31,24.57 21.59,24.85 v21.59,24.87 | 19.17,14.39 Q3.6 Q3.7 | 19.17,14.39 18.99,14.21 18.74,14.21 | 18.74,14.21 v18.29,14.21 | Q4.5 28.64,14.58 | 28.64,14.58 Q4.6 Q4.7 | X1.7 40.97,25.92 D6.C 40.51,23.09 S1.4 | 17.64,39.3 C18.2 17.61,39.36 | 27.71,40.2 27.87,40.03 NUCLEO_MAIN.VSS1 27.87,37.41 27.36,36.91 v27.36,36.72 | NUCLEO_MAIN.VREF- 35.87,34.77 33.79,36.84 | C23.2 31.89,41.79 31.89,42.71 | 31.89,42.71 v31.89,43.24 | D3.C 14.32,38.24 14.32,37.21 14.74,36.79 17.18,36.79 | NUCLEO_MAIN.VSS 34.37,38.06 | 34.37,38.06 34.37,37.81 34.08,37.53 33.77,37.53 v33.74,37.55 | 33.79,36.84 33.74,36.89 v33.74,37.55 | C15.2 22.19,31.34 23.76,29.77 NUCLEO_MAIN.VSS2 26.48,29.75 | C11.2 33.59,23.2 33.32,23.78 33.32,24.45 34.37,25.5 NUCLEO_MAIN.VSS3 34.37,33.7 33.91,34.17 33.91,34.34 | C11.2 32.9,22.7 R18.1 | C11.2 33.59,22.83 | v26.82,30.06 26.76,30 26.73,30 26.48,29.75 | 26.48,29.75 | Q2.5 10.01,15.19 10.01,15.01 | 10.01,15.01 10.01,14.92 | 10.01,14.92 10.01,14.9 9.94,14.22 | 9.94,14.22 v9.93,14.11 | v33.06,20.22 33.52,20.22 | 21.32,24.7 21.6,24.84 v21.59,24.87 | 21.23,24.48 21.32,24.7 | 21.32,24.7 21.43,24.94 v21.59,24.87 | 27.2,25.41 26.71,25.58 26.68,25.5 v26.68,25.41 | 27.2,25.41 27.11,25.37 26.74,25.24 v26.68,25.41 | 31.89,42.71 32.05,43.18 v31.89,43.24 | 31.89,42.71 31.72,43.18 v31.89,43.24 | 19.17,14.39 18.33,14.51 v18.29,14.21 | 19.17,14.39 18.44,13.95 v18.29,14.21
  Top 0.3: 10.01,15.01 9.65,14.24 v9.93,14.11 | 10.01,15.01 10.22,14.19 v9.93,14.11 | 17.18,36.79 17.38,36.72 REG.3 17.44,36.88 17.18,36.79 | 26.48,29.75 26.88,29.92 v26.82,30.06 | 26.48,29.75 26.68,30.14 v26.82,30.06 | 33.52,20.22 33.11,20.36 v33.06,20.22 | 33.52,20.22 33.11,20.07 v33.06,20.22 | 10.01,14.92 9.17,14.96 v9.15,14.66 | 10.01,14.92 9.33,14.42 v9.15,14.66 | 9.94,14.22 9.38,14.86 v9.15,14.66 | 9.94,14.22 9.1,14.36 v9.15,14.66 | 18.74,14.21 19.2,14.04 v19.26,14.21 19.2,14.38 18.74,14.21 | 28.64,14.58 28.86,15.39 v28.56,15.47 28.29,15.35 28.64,14.58 | 20.93,24.34 21.1,24.81 v20.93,24.87 | 20.93,24.34 20.76,24.8 v20.93,24.87 | 20.41,24.92 20.85,24.71 v20.93,24.87 | 20.41,24.92 20.89,25.04 v20.93,24.87 | 20.67,24.66 20.76,24.18 v20.93,24.21 | 20.67,24.66 21.05,24.34 v20.93,24.21 | 21.31,24.57 20.86,24.37 v20.93,24.21 | 21.31,24.57 21.09,24.13 v20.93,24.21 | 18.38,26.12 17.95,25.88 v18.03,25.73 18.2,25.66 18.38,26.12 | 26.53,39.47 26.5,39.42 | 34.37,38.06 33.84,37.47 v33.74,37.55 | 33.79,36.84 33.95,37.5 v33.74,37.55 | 33.79,36.84 33.5,37.44 v33.74,37.55
  Top 0.5: Q2.5 9.98,15.01 | 9.98,15.01 Q2.7 | Q2.6 9.93,14.51 9.93,14.2 | 9.93,14.2 v9.93,14.11 | 9.98,15.01 9.73,14.17 v9.93,14.11 | 9.98,15.01 10.13,14.15 v9.93,14.11 | 9.93,14.2 9.29,14.81 v9.15,14.66 9.09,14.47 9.93,14.2 | 37.67,21.63 37.17,22.13 | 37.86,22.85 37.98,22.97
  Top 0.6: SJ1.2 38.75,18.65 S1.3
  Top 0.7: C18.2 18.93,39.33 C12.2 20.19,40.59 24.58,40.59 C14.2 | 31.16,41.6 C23.2
  Top 1: SJ1.2 38.73,15.9 38.73,13.48 SJ2.2
  Top 1.5: v9.32,24.66 3.29,24.66 0.99,26.96 0.99,32.64 2.07,33.71 X2.3
  Bottom 0.3: v30.99,48.48 30.99,47.96 | 30.99,46.6 30.99,45.91 | 30.99,47.96 30.99,46.6 | 30.99,46.6 31.89,45.71 31.89,43.76 | 31.89,43.76 v31.89,43.24 | v21.59,24.87 21.96,25.24 | 21.89,25.07 26.27,25.07 25.94,25.41 | U2.13 24.28,27.07 25.94,25.41 | 25.94,25.41 26.15,25.41 | 26.15,25.41 v26.68,25.41 | v26.82,30.06 26.93,30.06 27.19,29.8 | 27.7,29.29 27.19,29.8 | 33.91,34.34 32.21,34.34 29.89,36.66 | 21.96,25.24 21.52,25.03 v21.59,24.87 | 21.96,25.24 21.89,25.07 | 21.89,25.07 21.75,24.79 v21.59,24.87 | 26.15,25.41 26.62,25.24 v26.68,25.41 | 26.15,25.41 26.62,25.57 v26.68,25.41 | 30.99,47.96 31.16,48.42 v30.99,48.48 | 30.99,47.96 30.82,48.42 v30.99,48.48 | 31.89,43.76 31.72,43.3 v31.89,43.24 | 31.89,43.76 32.05,43.3 v31.89,43.24 | 27.19,29.8 26.94,30.15 v26.82,30.06 | 27.19,29.8 26.78,29.91 v26.82,30.06
  Bottom 0.5: C2.1 19.1,14.59 | 19.1,14.59 18.74,14.22 | 18.74,14.22 18.73,14.21 v18.29,14.21 | 28.52,16.68 28.52,18.33 28.66,18.47 | 28.52,16.68 28.52,16.37 | 28.52,16.37 C6.1 | 28.66,18.47 29.62,19.44 32.28,19.44 v33.06,20.22 | 19.1,14.59 18.25,14.41 v18.29,14.21 | 19.1,14.59 18.41,14.05 v18.29,14.21 | 18.74,14.22 19.25,14.13 v19.26,14.21 19.25,14.29 18.74,14.22 | 28.52,16.68 28.81,17.5 v28.62,17.57 | 28.52,16.68 28.42,17.55 v28.62,17.57 | 28.66,18.47 28.43,17.62 v28.62,17.57 | 28.66,18.47 28.82,17.61 v28.62,17.57 | 28.52,16.37 28.37,15.51 v28.56,15.47 28.76,15.53 28.52,16.37 | 30.99,45.91 29.11,44.03 27.59,44.03 27.5,44.12 D2.C
  Bottom 1: 10.84,28.69 C19.1 C20.1 C21.1 10.48,22.27 v9.67,21.46 9.9,21.23 9.9,17.02 18.93,17.02 | 10.84,29.23 10.84,31.32 C17.1 C13.1 C22.1 11.3,37.97 | 19.42,39.12 18.1,37.8 17.93,37.97 | C6.1 25.92,17.32 18.63,17.32 18.93,17.02 | 9.68,17.02 9.93,16.78 v9.93,14.11 | C2.1 19.23,16.71 18.93,17.02 | D2.C D1.C | 18.87,35.49 18.87,34.6 | 18.87,34.6 18.87,33.97 17.11,33.97 v17.56,34.42 | v19.77,34.93 19.53,34.7 19.53,34.3 18.33,33.1 v17.94,33.1 19.45,34.6 18.87,34.6
  other vias: 17.81,37.92 8.81,16.18 19.41,15.88 17.46,15.88 17.43,16.88 17.4,18.55 8.81,17.47 10.72,19.97 12.28,18.74 26.58,17.03 28.62,16.54 26.6,16.02 27.41,14.56 26.6,18.14 18.32,15.13 9.47,18.79 19.74,17.04 20.53,18.55 20.27,24.87 20.27,23.55 21.59,23.55 20.27,24.21 21.59,24.21 20.93,23.55 25.41,26.39 24.89,24.58 29.91,25.3 31.57,20.22 32.98,22.31 32.98,24.09 18.03,25.07 9.39,22.93 15.19,22.83 16.31,27.69 13.71,27.78 12.83,22.83 12.8,24.72 15.16,24.66 18.73,41.11 21.52,42.23 23.94,41.87 21.12,39.57 23.31,39.64 34.4,35.29 32.55,42.58 32.52,43.47 33.36,33.45 33.33,32.56 25.27,37.59 20.98,37.77 20.57,31.79 16.9,34.88 16.9,33.96 18.92,18.49 28.93,21.71 14.72,21.32 12.3,21.26 13.51,19.97 10.99,17.44 29.13,40.37 26.81,42.33 29.94,42.73 31.83,40.32 26.64,39.3 26.55,37.15 13.73,23.72 13.75,25.47 16.11,25.27 29.6,37.53 28.91,35.92 30.95,37.58 30.49,32.56 27.36,34.51 34.42,41.46 35.86,38.82 34.17,30.18 31.21,29.66 29.17,29.29 28.14,30.35 35.63,31.19 25.49,20.12 35.67,42.57 26.5,35.81 31.9,22.34 29.89,23.45 24.23,37.61 19.11,39.15 21.99,33.42 14.61,36.93 14.27,38.67 23.06,36.9 20.31,37.24 14.04,40.41 19.23,31.75 9.64,38.5 11.38,38.53 11.34,31.84 9.57,31.84 9.64,35.15 11.34,35.15 10.51,36.96 10.47,33.48 9.6,49.06 9.6,47.19 12.55,49.13 17.3,49.09 20.45,49.09 24.5,49.16 27.82,49.13 29.99,49.16 12.62,47.15 17.34,47.15 20.58,47.15 24.64,47.12 27.05,47.09 28.62,44.11 24.7,44.14 18.11,44.17 14.12,44.17 9.7,44.07
  pour Top (no thermals): 26.99,18 29.06,18 29.06,13.7 26.99,13.7
  pour Top (no thermals): 16.97,16.43 19.78,16.43 19.78,13.73 16.97,13.73
  pour Top (no thermals): 8.36,19.5 10.45,19.5 10.45,13.67 8.36,13.67
  pour Bottom (no thermals): 8.39,19.47 29.37,19.47 29.37,13.35 25.58,13.35 25.58,16.87 20.41,16.87 20.41,13.24 16.28,13.24 16.28,16.47 11.6,16.47 11.6,13.18 10.05,13.18 8.39,14.85
  pour Top (no thermals): 24.15,26.7 25.84,26.7 26.9,25.64 31.01,25.64 31.01,24.49 31.18,24.32 32.5,24.32 33.22,25.04 33.22,26.16 34.51,26.16 34.51,23.75 37.29,23.75 37.29,28.22 41.63,28.22 41.63,22.23 40.17,22.23 40.17,18.91 29.89,18.91 29.89,20.01 25.84,24.06 24.15,24.06
  pour Bottom (no thermals): 17.6,25.99 23.26,25.99 23.26,32.24 36.75,32.24 36.75,19.01 25.38,19.01 25.01,18.64 25.01,22.38 19.88,22.38 17.6,24.66
  pour Top (no thermals): 3.4,28.06 18.19,28.06 22.14,24.12 22.14,19.25 3.4,19.25
  pour Top (no thermals): 16.49,40.9 18.6,43.01 31.09,43.01 31.95,43.87 35.09,43.87 39.07,39.89 28.7,39.89 27.72,38.91 20.21,38.91 17.5,36.2 12.84,36.2 12.84,40.9
  pour Bottom (no thermals): 9.18,49.7 31.61,49.7 32.87,48.44 32.87,41.86 32.16,41.14 32.16,37.67 13.75,19.26 9.18,19.26
  pour Bottom (no thermals): 33.86,42.85 36.23,42.85 36.23,33.94 34.19,31.9 28.54,31.9 28.54,37.53
  pour Top (no thermals): 32.93,34.6 34.74,34.6 34.74,30.41 34.65,30.32 34.65,29.09 34.02,29.09 32.67,30.44 32.67,34.34
  pour Top (no thermals): 16.6,38.44 16.6,33.89 20.02,30.46 21.77,30.46 21.77,29.6 26.11,29.6 26.11,38.44
  pour Top (no thermals): 25.04,20.53 26.62,20.53 29.08,18.06 29.08,17.52 29.06,17.49 29.06,15.65 28.85,15.45 26.04,15.45 26.04,18.84 25.27,19.61 25.04,19.61
  pour Top (no thermals): 16.94,19.01 21.1,19.01 21.1,17.66 19.78,16.34 16.97,16.34 16.94,16.37
  pour Top (no thermals): 8.84,21.77 15.3,21.77 15.3,20.99 10.45,16.14 10.22,16.14 8.84,17.52
  pour Top (no thermals): 8.2,27.22 8.58,12.94 7.24,14.29 7.24,18.41 8.2,19.37
  pour Top: 25.78,39.39 36.58,39.39 37.18,38.79 37.18,27.08 25.78,27.08
  pour Top: 0.61,27.43 5.26,27.43 5.86,28.03 6.16,28.03 6.16,23.48 8.91,20.73 4.56,20.73 0.3,24.98 0.3,27.12
  pour Top (no thermals): 3.22,34.42 4.15,34.42 8.74,39.01 11.86,39.01 11.86,31.41 11.79,31.34 8.61,31.34 7.9,32.05 7.84,32.05 7.6,32.28 3.85,32.28 3.22,32.92
  pour Top (no thermals): 31.71,49.42 31.71,43.26 17.58,43.26 15,40.69 13.6,40.69 13.6,43.13 9.24,43.13 9.24,49.93 9.95,50.63 30.5,50.63
GVDD
  Top 0.3: U1.GVDD U1.MODE 20.41,26.35 20.41,26.96 18.68,28.69 17.82,28.69 17.62,28.89
  Top 0.5: C9.2 12.32,30.1 12.32,40.16 R27.2
  Top 0.6: JP2.2 8.86,30.62 C16.2
  pour Top (no thermals): 7.98,31.03 13.72,31.03 14.71,30.03 19.44,30.03 20.76,28.72 20.76,26.57 20.1,26.57 18.34,28.34 7.98,28.34
GVDD_IN
  Top 0.6: JP2.1 6.08,28.63 X2.1
HA
  Top 0.3: Q4.1 34.49,13.27 R5.2
HB
  Top 0.3: Q3.1 24.49,13.27 R3.2
HC
  Top 0.3: Q2.1 15.27,13.27 R1.2
INA  (via drill 0.35)
  Top 0.3: U1.INHA 23.8,24.44 24.72,25.35 24.72,26.93 | 24.72,26.93 24.72,27.11 24.93,27.11 | 24.72,26.93 24.15,27.51 22.57,27.51 22.15,27.09 22.15,26.15 U1.INLA | NUCLEO_MAIN.PC7 26.2,34.27 27.48,32.99 27.48,29.8 27.24,29.57 | v25.44,27.25 25.29,27.11 24.93,27.11 | v26.87,29.2 | 27.24,29.57 v26.87,29.2 | 24.93,27.11 25.43,27.07 v25.44,27.25 | 24.93,27.11 25.33,27.39 v25.44,27.25 | 27.24,29.57 26.8,29.36 v26.87,29.2 | 27.24,29.57 27.03,29.12 v26.87,29.2
  Bottom 0.3: 25.45,27.77 25.44,27.77 v25.44,27.25 | 25.45,27.77 26.5,28.83 | 26.5,28.83 v26.87,29.2 | 25.45,27.77 25.27,27.31 v25.44,27.25 | 25.45,27.77 25.61,27.31 v25.44,27.25 | 26.5,28.83 26.95,29.04 v26.87,29.2 | 26.5,28.83 26.71,29.28 v26.87,29.2
INB  (via drill 0.35)
  Top 0.3: U1.INHB 22.89,24.91 23.55,24.91 24.26,25.63 24.26,26.63 23.9,26.99 23.11,26.99 | 23.11,26.99 23.1,26.99 22.74,26.63 v22.81,26.56 | v21.82,27.65 21.64,27.47 21.64,27.16 | 21.64,27.16 21.64,26.16 U1.INLB | v21.82,27.65 22.19,28.02 | 22.19,28.02 22.25,28.08 25.81,28.08 26.23,27.66 26.23,26.93 27.1,26.06 30.65,26.06 30.87,26.29 NUCLEO_MAIN.PB4 | 23.11,26.99 22.71,26.7 v22.81,26.56 | 23.11,26.99 22.98,26.51 v22.81,26.56 | 21.64,27.16 21.64,27.65 v21.82,27.65 | 22.19,28.02 21.74,27.81 v21.82,27.65 | 22.19,28.02 21.98,27.57 v21.82,27.65
  Bottom 0.3: 22.42,26.91 22.77,26.56 v22.81,26.56 | 22.42,26.91 22.11,27.21 | 22.11,27.21 21.82,27.51 v21.82,27.65 | 22.42,26.91 22.66,26.47 v22.81,26.56 | 22.42,26.91 22.88,26.72 v22.81,26.56 | 22.11,27.21 21.99,27.69 v21.82,27.65 | 22.11,27.21 21.71,27.51 v21.82,27.65
INC  (via drill 0.35)
  Top 0.3: U1.INHC 22.9,25.47 23.24,25.82 v23.34,25.73 | 23.1,25.73 v23.34,25.73 | 21.12,28.18 21.12,28.21 v21.48,28.57 | 21.12,28.18 21.12,26.84 21.18,26.78 U1.INLC | NUCLEO_MAIN.PB10 28.87,37.69 28.19,37 28.19,34.97 29,34.16 29,30.23 27.33,28.57 22,28.57 | v21.48,28.57 22,28.57 | v23.34,25.73 23.36,25.71 | 21.12,28.18 21.56,28.41 v21.48,28.57 | 21.12,28.18 21.32,28.64 v21.48,28.57 | 22,28.57 21.54,28.73 v21.48,28.57 | 22,28.57 21.54,28.4 v21.48,28.57
  Bottom 0.3: 21.19,28.13 21.19,27.29 22.75,25.73 v23.34,25.73 | 21.19,28.13 21.19,28.28 v21.48,28.57 | 21.19,28.13 21.59,28.43 v21.48,28.57 | 21.19,28.13 21.31,28.61 v21.48,28.57
L
  Top 0.3: D3.A R20.1
LA
  Top 0.3: Q4.8 28.39,13.02 R6.2
LB
  Top 0.3: Q3.8 19.1,13.02 R4.2
LC
  Top 0.3: Q2.8 9.73,13.02 R2.2
LED  (via drill 0.35)
  Top 0.3: NUCLEO_MAIN.PC14 36.97,30.22 35.92,30.22 35.37,29.67 35.37,25.53 35.61,25.29 | v36.09,25.07 35.8,25.07 35.58,25.29 | 35.58,25.29 35.95,24.93 v36.09,25.07 | 35.58,25.29 35.61,25.29 | 35.61,25.29 36.1,25.25 v36.09,25.07 | v40.03,18.07 40.7,18.07 R23.2
  Bottom 0.3: v36.09,25.07 36.09,25.03 40.03,21.09 v40.03,18.07
LEDB
  Top 0.3: NUCLEO_MAIN.PB13 R24.8
LEDG
  Top 0.3: R24.6 23.74,35.26 24.53,35.26 24.53,35.27 NUCLEO_MAIN.PB15
LEDR
  Top 0.3: NUCLEO_MAIN.PB14 25.17,35.72 24.35,35.72 24.34,35.71 R24.7
MISO  (via drill 0.35)
  Top 0.3: v30.26,34.66 30.29,34.66 30.65,35.01 | 30.65,35.01 32.37,36.74 NUCLEO_MAIN.PA6 | 30.65,35.01 30.19,34.82 v30.26,34.66 | 30.65,35.01 30.42,34.57 v30.26,34.66
  Bottom 0.3: U2.3 18.69,27.72 19.56,28.59 19.56,29.02 23.59,33.05 28.65,33.05 29.89,34.28 | 29.89,34.28 v30.26,34.66 | 29.89,34.28 30.34,34.49 v30.26,34.66 | 29.89,34.28 30.1,34.73 v30.26,34.66
MOSI  (via drill 0.35)
  Top 0.3: NUCLEO_MAIN.PA7 31.87,37.44 30.11,35.68 | 30.11,35.68 29.74,35.31 v29.69,35.37 | 30.11,35.68 29.64,35.54 v29.69,35.37 | 30.11,35.68 29.83,35.27 v29.69,35.37
  Bottom 0.3: v29.69,35.37 29.32,35 | 29.32,35 27.94,33.62 23.46,33.62 19.06,29.23 19.06,28.73 18.7,28.37 U2.4 | 29.32,35 29.76,35.21 v29.69,35.37 | 29.32,35 29.53,35.45 v29.69,35.37
N$14  (via drill 0.35)
  Top 0.5: D1.A R19.1
  Bottom 0.3: D1.A 11.24,42.34
  other vias: 11.26,42.36
N$15  (via drill 0.35)
  Bottom 0.5: R27.1 12.9,42.37 D2.A
  other vias: 12.9,42.44
N$21
  Top 0.3: D6.A R23.1
NRST
  Top 0.3: X1.3 39.41,35.26 39.41,32.63 38.93,32.16 | 38.93,32.16 R21.2 | NUCLEO_MAIN.NRST 38.82,32.27 38.93,32.16
PVDD  (via drill 0.5, 0.6, 0.8)  (1 unrouted)
  Top 0.3: Q2.10 12.29,14.81 | 12.29,14.81 12.29,15.66 | 12.29,15.87 v12.29,15.88 | Q2.3 13.26,14.71 12.93,15.04 | 12.93,15.04 12.9,15.07 | v12.29,15.88 12.72,15.45 12.9,15.07 | Q2.4 13.26,14.84 | 13.26,14.84 Q2.3 | Q2.2 13.37,14.02 | 13.37,14.02 13.42,14.07 | 13.42,14.07 13.59,14.24 13.44,14.39 | 13.44,14.39 Q2.3 | Q3.4 22.63,15.15 | 22.63,15.15 22.63,14.8 | 22.63,14.8 Q3.3 22.63,14.48 | 22.63,14.48 Q3.2 | Q4.4 Q4.3 | Q4.3 Q4.2 | v30.48,17.87 30.48,16.97 | 30.48,16.97 30.48,16 | Q4.3 31.45,15.03 31.44,15.06 | 12.29,14.81 12.6,15.77 v12.29,15.88 | 12.29,14.81 11.93,15.73 | 12.9,15.07 12.09,15.45 v12.29,15.88 | 30.48,16.97 30.76,17.77 v30.48,17.87 | 30.48,16.97 30.19,17.77 v30.48,17.87 | 12.29,15.66 11.98,14.87 12.26,14.76 12.55,14.85 12.29,15.66 | 12.93,15.04 13.96,14.44 v14.21,14.88 | 12.93,15.04 14.16,15.24 v14.21,14.88 | 13.42,14.07 14.12,14.76 14.12,14.79 v14.21,14.88 | 13.42,14.07 13.52,14.95 v14.21,14.88 | 22.63,14.48 23.25,13.91 v23.46,14.13 23.48,14.43 22.63,14.48 | 22.63,15.15 22.99,16.08 v22.72,16.19 22.33,16.06 22.63,15.15 | 22.63,14.8 23.48,14.77 v23.49,15.08 23.3,15.32 22.63,14.8 | 13.26,14.84 13.6,15.78 v13.43,15.84 12.97,15.67 13.26,14.84 | 13.37,14.02 14.17,14.33 14.37,13.81 14.4,14.34 13.44,14.39 | v30.51,16.94 30.5,16.92
  Top 0.5: R19.2 9.58,40.72 7.44,38.58 v7.44,38.31
  Top 0.6: X2.2 3.89,31.61 7.03,31.61 JP2.3
  Bottom 0.3: C5.2 13.34,14.84 | 13.34,14.84 12.97,15.21 | 12.47,15.71 12.38,15.8 | 12.97,15.21 12.47,15.71 | 12.47,15.71 12.37,15.71 | C6.2 31.58,15.17 | 30.48,16.27 30.48,16.54 | 30.48,16.54 30.48,16.57 30.48,16.71 30.48,16.97 | 30.48,16.97 v30.48,17.87 | 30.48,16.97 30.76,17.77 v30.48,17.87 | 30.48,16.97 30.19,17.77 v30.48,17.87 | 12.97,15.21 13.84,14.45 v14.21,14.88 14.22,15.16 12.97,15.21 | 13.34,14.84 13.59,15.79 v13.43,15.84 | 13.34,14.84 12.98,15.63 v13.43,15.84 | 12.37,15.71 13.3,15.41 v13.43,15.84 | 12.37,15.71 12.79,15.88 | v13.43,15.84 13.34,16.09 | 30.48,16.54 30.49,16.46
  Bottom 0.5: v7.44,38.31 7.56,38.18
  Bottom 1: C13.2 C17.2 C19.2 C20.2 C21.2 7.56,13.2 8.62,12.15 13.44,12.15 | C6.2 32.03,13.22 30.96,12.15 22.65,12.15 | 22.65,12.15 13.44,12.15 | C5.2 13.38,12.21 13.44,12.15 | C2.2 22.74,12.24 22.65,12.15
  other vias: 15.64,11.84 14.48,15.87 13.76,11.84 21.56,16.18 23.91,10.9 23.8,16.08 24.94,10.89 32.92,17.9 33.46,14.18 31.28,16.27 32.02,11.01 33.2,11.2 14.7,11.84 33.5,15.39 31.71,17.84 22.9,10.89 33.41,16.67 21.79,11.22 24.91,11.89 12.82,11.84 33.56,12.45 31.08,11.61
  pour Top (no thermals): 11.83,16.31 16.11,16.31 16.11,11.33 11.83,11.33
  pour Bottom (no thermals): 11.89,12.89 11.89,16.18 16.02,16.18 16.02,12.98 20.7,12.98 20.7,16.61 25.32,16.61 25.32,13.1 29.63,13.1 29.63,18.75 34.18,18.75 34.18,11.44 32.94,10.2 8.1,10.2 8.1,14.7 9.91,12.89
  pour Top (no thermals): 21.17,16.83 25.52,16.83 25.52,10.33 21.81,10.33 21.17,10.97
  pour Top (no thermals): 30.03,18.56 33.96,18.56 33.96,10.98 33.57,10.58 31.4,10.58 30.43,11.55 30.43,15.77 30.09,15.77 30.03,15.82
  pour Bottom (no thermals): 6.97,38.91 8.84,38.91 8.84,20.39 8.04,19.59 8.04,10.15 4.72,6.83 -0.77,12.33 -0.77,25.55 0.71,27.02 5.8,27.02 6,27.23 6,35.56 6.97,36.53
R_  (1 unrouted)
  Top 0.3: 22.64,35.73 21.82,35.73 21.19,35.09 20.92,35.09 19.23,33.41 U$1.3
SW  (1 unrouted)
  Top 0.3: NUCLEO_MAIN.PC13 36.17,29.77 35.85,29.44 35.85,26.21 36.81,25.25 36.81,23.18 S1.2
SWCLK  (via drill 0.35)
  Top 0.3: v31.24,28.57 30.71,28.57 | 30.71,28.57 27.99,28.57 27.37,27.95 NUCLEO_MAIN.PA14 | 30.71,28.57 31.18,28.4 v31.24,28.57 | 30.71,28.57 31.18,28.74 v31.24,28.57
  Bottom 0.3: X1.5 36.79,31.37 34.02,28.6 31.76,28.6 | v31.24,28.57 31.27,28.6 31.76,28.6 | 31.76,28.6 31.29,28.74 v31.24,28.57 | 31.76,28.6 31.31,28.41 v31.24,28.57
SWDIO  (via drill 0.35)
  Top 0.3: NUCLEO_MAIN.PA13 25.23,30.27 26.13,30.27 26.55,30.69 26.55,31.32 | v26.53,31.84 26.55,31.83 26.55,31.32 | 26.55,31.32 26.7,31.79 v26.53,31.84 | 26.55,31.32 26.36,31.78 v26.53,31.84
  Bottom 0.3: 27.05,31.84 33.78,31.84 37.34,35.4 39.04,35.4 40.53,33.91 X1.4 | 27.05,31.84 v26.53,31.84 | 27.05,31.84 26.59,32.01 v26.53,31.84 | 27.05,31.84 26.59,31.67 v26.53,31.84
U  (via drill 0.35)
  Top 0.3: U1.SHC 17.93,21.87 17.93,20.68 | 17.93,20.68 17.93,20.45 18.14,20.25 18.14,20.19 v18.12,20.19 | Q2.9 10.98,14.33 11,14.34 11,15.94 14.86,19.8 | v18.12,20.19 C1.2 | v15.25,20.16 15.22,20.16 14.86,19.8 | 11.07,9.5 10.45,9.5 | 17.93,20.68 17.95,20.19 v18.12,20.19 | 17.93,20.68 18.26,20.31 v18.12,20.19 | 14.86,19.8 15.32,20 v15.25,20.16 | 14.86,19.8 15.09,20.24 v15.25,20.16
  Top 0.5: ..11 16.54,2.15 | 16.54,2.15 16.54,1.64 ..10 | 14.56,8.84 15.77,8.84 16.54,8.07 16.54,2.15
  Top 1: Q2.9 11.07,9.5 11.07,8.8
  Bottom 0.3: v18.12,20.19 17.6,20.19 | 17.6,20.19 15.77,20.19 | 15.77,20.19 15.25,20.19 v15.25,20.16 | 17.6,20.19 18.06,20.03 v18.12,20.19 | 17.6,20.19 18.06,20.36 v18.12,20.19 | 15.77,20.19 15.29,20.33 v15.25,20.16 | 15.77,20.19 15.32,20 v15.25,20.16
  pour Top (no thermals): 10.74,15.65 11.54,15.65 11.54,7.76 8.82,7.76 7.58,8.99 7.58,12.15 9.36,12.15 10.74,13.53
  pour Top (no thermals): 15.5,0.61 17.31,0.61 17.31,11.05 11.15,11.05 11.15,7.74 12.56,7.74 15.5,4.79
USBRX
  Top 0.3: X1.1 40.26,41.19 36.4,41.19 34.87,39.67 NUCLEO_MAIN.PA3
  Top 0.5: X1.1 38.66,43.47 37.3,43.47 35.89,44.88 JP1.1
USBTX
  Top 0.3: X1.2 38.37,36.77 NUCLEO_MAIN.PA2
V  (via drill 0.35)
  Top 0.3: U1.SHB 20.68,20.95 21.19,20.44 | C3.2 21.65,20.07 v21.61,20.11 | v21.61,20.11 21.52,20.11 21.19,20.44 | Q3.9 20.43,16.44 21.73,17.75 21.73,18.2 | 21.73,18.2 v21.73,18.72 | 21.73,18.2 21.9,18.66 v21.73,18.72 | 21.73,18.2 21.57,18.66 v21.73,18.72 | 21.19,20.44 21.45,20.02 v21.61,20.11 | 21.19,20.44 21.66,20.28 v21.61,20.11
  Top 0.5: ..9 18.69,1.64 | 18.69,1.64 ..8 | 18.69,1.64 18.69,10.55 20.43,12.3 Q3.9
  Bottom 0.3: v21.61,20.11 21.73,19.99 21.73,19.61 | 21.73,19.61 21.73,19.25 | 21.73,19.25 v21.73,18.72 | 21.73,19.25 21.57,18.78 v21.73,18.72 | 21.73,19.25 21.9,18.78 v21.73,18.72 | 21.73,19.61 21.78,20.1 v21.61,20.11 | 21.73,19.61 21.46,20.02 v21.61,20.11
  pour Top (no thermals): 17.58,0.64 19.36,0.64 19.36,4.29 20.9,5.83 20.9,12.86 19.99,12.86 19.76,12.63 18.45,12.63 17.58,11.76
VCAP
  Top 0.3: NUCLEO_MAIN.VCAP_1 28.37,40.34 28.02,40.68 26.7,40.68 C14.1
VDDA
  Top 0.3: BEAD.1 36.68,38.2 35.86,37.38 35.86,35.55 36.17,35.24 36.99,35.24 NUCLEO_MAIN.VREF+
W
  Top 0.3: U1.SHA 23.1,21.33 C7.2 26.33,21.33 29.6,18.05 29.6,14.36 Q4.9
  Top 0.5: ..7 20.83,1.64 | 20.83,1.64 ..6 | 20.83,1.64 20.83,4.79 25.43,9.4
  Top 1: Q4.9 29.72,12.17
  pour Top (no thermals): 29.15,13.44 29.15,11.4 29.49,11.4 29.8,11.09 29.8,7.67 30.6,7.67 30.6,10.98 30.17,11.4 30.17,13.44
  pour Top (no thermals): 19.62,0.57 21.33,0.57 21.43,0.67 21.43,2.65 25.25,6.47 30.67,6.47 30.67,10.92 29.57,12.02 26.22,12.02 25.92,11.72 25.92,10.28 25.58,9.95 22.13,9.95 21.16,8.98 21.16,5.73 19.62,4.19

### Text on the board
bPlace: PVDD | GVDD | L | TX | H | RX | 5V | NRST | GND | DIO | P | CLK | G | 3V3 | GND | 00 : 0 / 01 : 1 / 10 : 2 / 11 : 3